# EAGLE schematic version_1 (EAGLE 6.1)

## Sheet 1 of 2
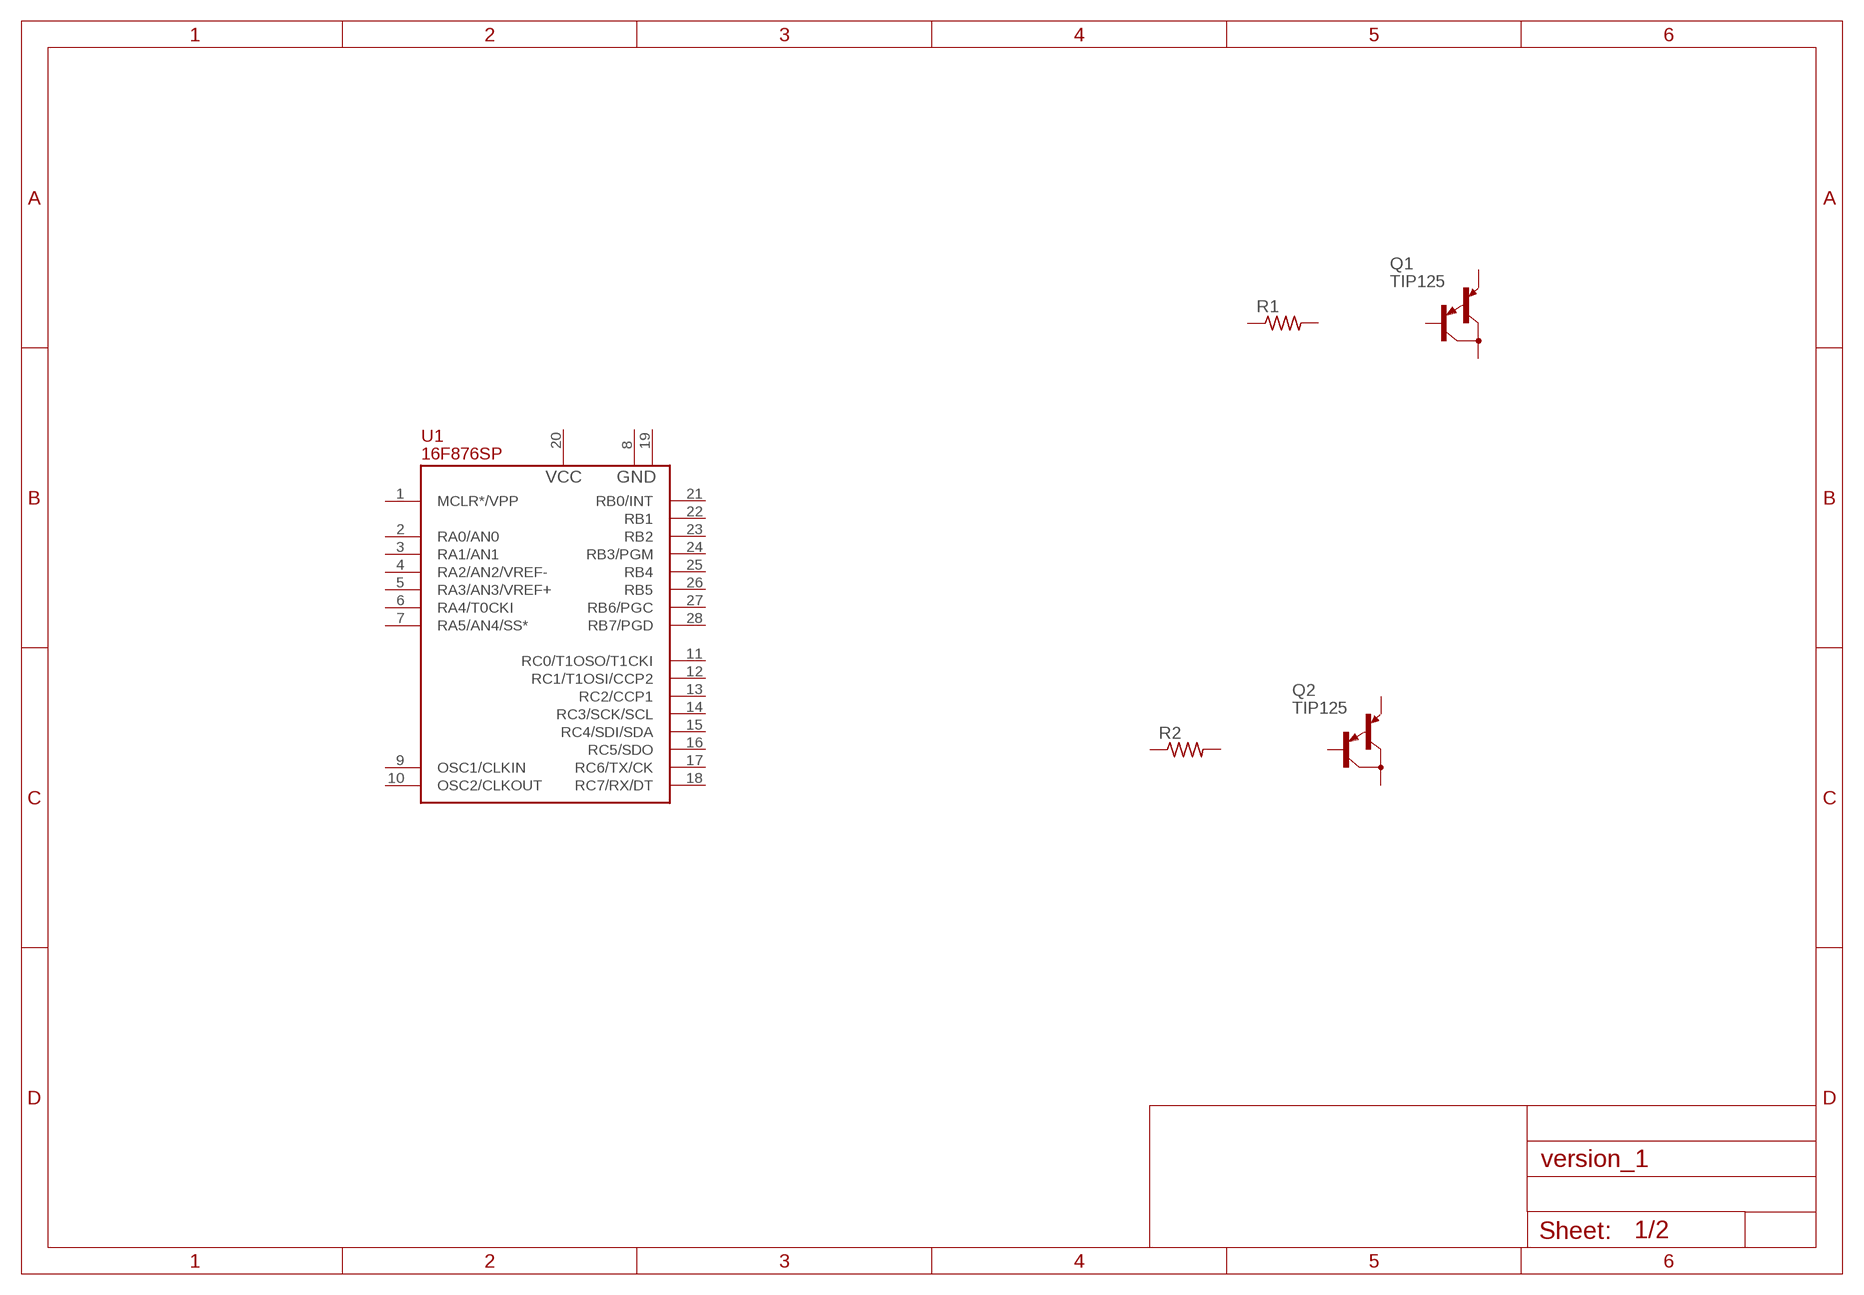
[diagram p0: schematic, sheet 1]

### Parts
Q1  TIP125  [TO220]
Q2  TIP125  [TO220]
R1  R-US_0204/7  [0204/7]
R2  R-US_0204/7  [0204/7]
U1  16F876SP  [DIL28-3]
Unconnected: Q1.1(B) Q1.2(C) Q1.3(E) Q2.1(B) Q2.2(C) Q2.3(E) R1.1 R1.2 R2.1 R2.2 U1.1(MCLR*/VPP) U1.2(RA0/AN0) U1.3(RA1/AN1) U1.4(RA2/AN2/VREF-) U1.5(RA3/AN3/VREF+) U1.6(RA4/T0CKI) U1.7(RA5/AN4/SS*) U1.8(GND) U1.9(OSC1/CLKIN) U1.10(OSC2/CLKOUT) U1.11(RC0/T1OSO/T1CKI) U1.12(RC1/T1OSI/CCP2) U1.13(RC2/CCP1) U1.14(RC3/SCK/SCL) U1.15(RC4/SDI/SDA) U1.16(RC5/SDO) U1.17(RC6/TX/CK) U1.18(RC7/RX/DT) U1.19(GND) U1.21(RB0/INT) U1.22(RB1) U1.23(RB2) U1.24(RB3/PGM) U1.25(RB4) U1.26(RB5) U1.27(RB6/PGC) U1.28(RB7/PGD)

## Sheet 2 of 2
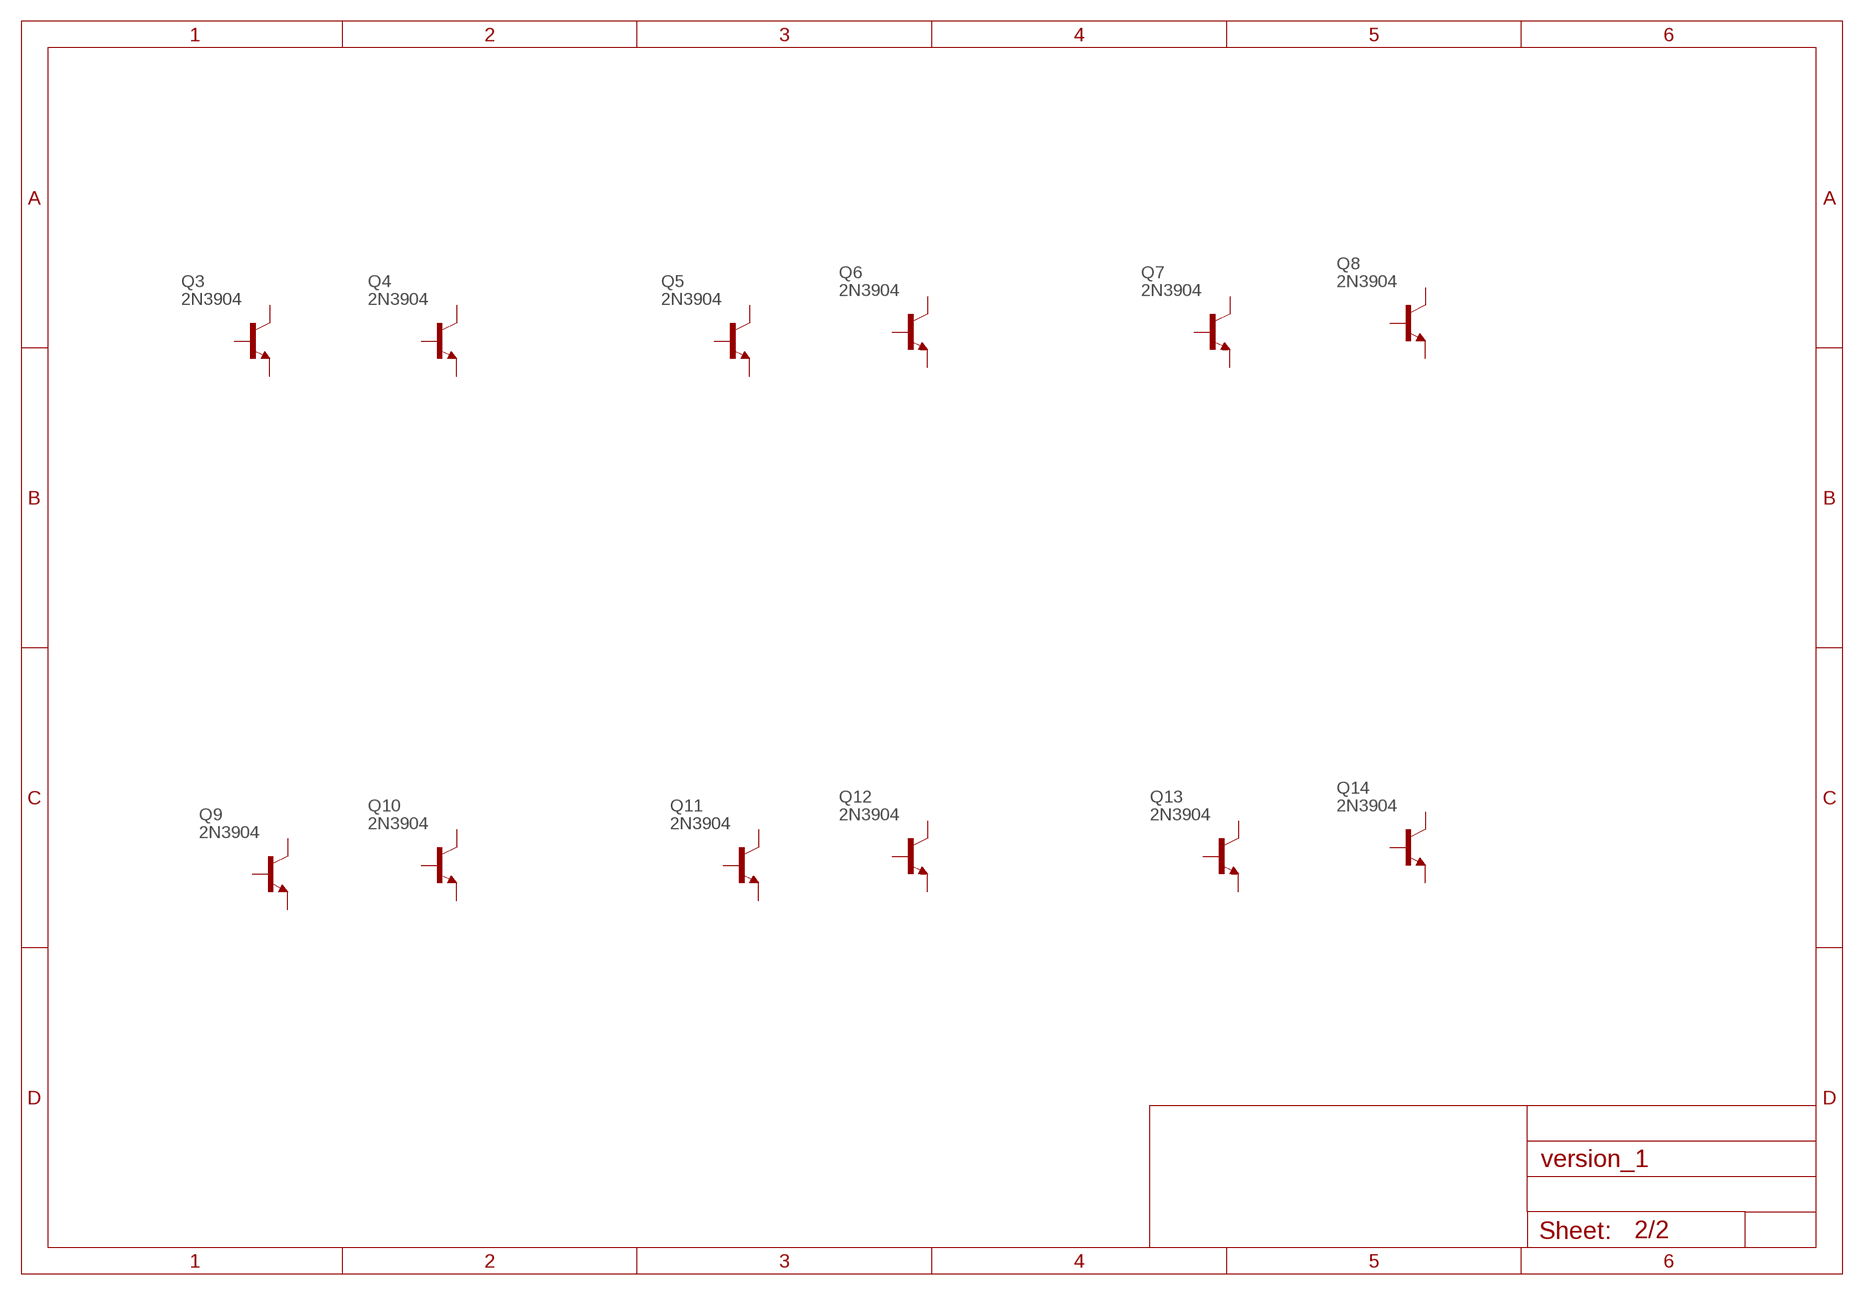
[diagram p1: schematic, sheet 2]

### Parts
Q3  2N3904  [TO92]
Q4  2N3904  [TO92]
Q5  2N3904  [TO92]
Q6  2N3904  [TO92]
Q7  2N3904  [TO92]
Q8  2N3904  [TO92]
Q9  2N3904  [TO92]
Q10  2N3904  [TO92]
Q11  2N3904  [TO92]
Q12  2N3904  [TO92]
Q13  2N3904  [TO92]
Q14  2N3904  [TO92]
Unconnected: Q3.1(C) Q3.2(B) Q3.3(E) Q4.1(C) Q4.2(B) Q4.3(E) Q5.1(C) Q5.2(B) Q5.3(E) Q6.1(C) Q6.2(B) Q6.3(E) Q7.1(C) Q7.2(B) Q7.3(E) Q8.1(C) Q8.2(B) Q8.3(E) Q9.1(C) Q9.2(B) Q9.3(E) Q10.1(C) Q10.2(B) Q10.3(E) Q11.1(C) Q11.2(B) Q11.3(E) Q12.1(C) Q12.2(B) Q12.3(E) Q13.1(C) Q13.2(B) Q13.3(E) Q14.1(C) Q14.2(B) Q14.3(E)

## Power pins joined to a net without a drawn wire
VCC: U1.20(VCC)

## Library data of the parts
Q1 Q2 = transistor-pnp:TIP125: PNP Transistor
Q3-Q14 = -redpic-diode-transistor:2N3904: NPN Transistor
R1 R2 = rcl:R-US_: RESISTOR, American symbol
U1 = -redpic-microchip-pic:16F876: Microchip PIC 16F876